# EAGLE design SparkFun_GP-2106_Breakout (EAGLE 7.2.0)
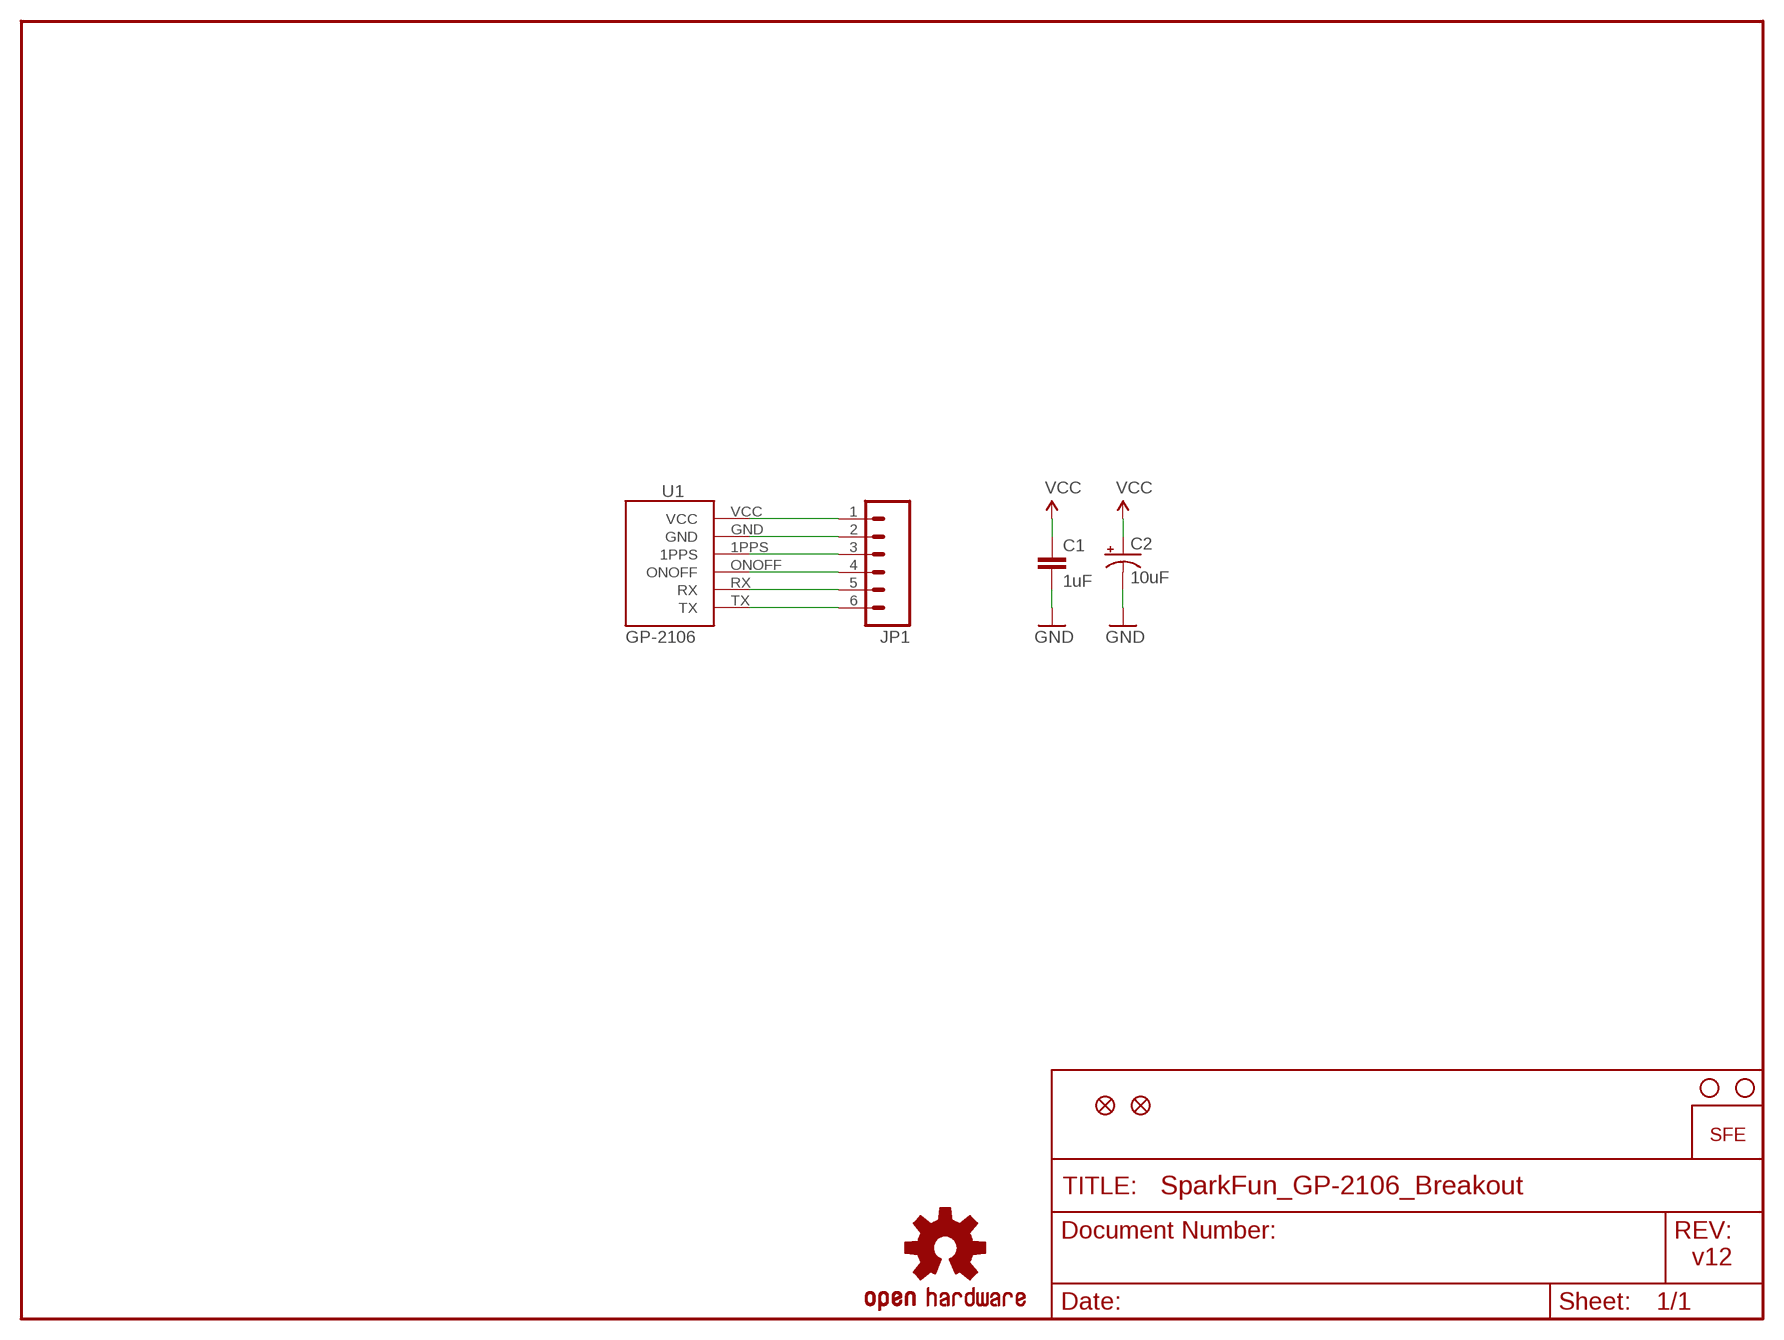
[diagram p0: schematic, sheet 1]

## Parts
C1  1uF  CAP0402-CAP  [0402-CAP]
C2  10uF  CAP_POL1206  [EIA3216]
JP1  M06SIP  [1X06]
JP2  STAND-OFF  [STAND-OFF]
JP3  STAND-OFF  [STAND-OFF]
JP4  LOGO-SFESK  [SFE-LOGO-FLAME]
JP5  FIDUCIALUFIDUCIAL  [MICRO-FIDUCIAL]
JP6  FIDUCIALUFIDUCIAL  [MICRO-FIDUCIAL]
U1  GP-2106  [GP-2106]
U$1  OSHW-LOGOS  [OSHW-LOGO-S]

## Nets
1PPS: JP1.3 U1.1PPS
GND: C1.2 C2.C(-) JP1.2 U1.GND
ONOFF: JP1.4 U1.ONOFF
RX: JP1.5 U1.RX
TX: JP1.6 U1.TX
VCC: C1.1 C2.A(+) JP1.1 U1.VCC

## Notes on the sheet
- v12

## Library data of the parts
C1 = SparkFun:CAP: Capacitor Standard 0603 ceramic capacitor, and 0.1" leaded capacitor.
C2 = SparkFun:CAP_POL: Capacitor Polarized These are standard SMD and PTH capacitors. Normally 10uF, 47uF, and 100uF in electrolytic and tantalum varieties. Always verify the external diameter of the through hole cap, it varies with capacity, voltage, and manufacturer. The EIA devices should be standard.
JP1 = SparkFun:M06: Header 6 Standard 6-pin 0.1" header. Use with straight break away headers (SKU : PRT-00116), right angle break away headers (PRT-00553), swiss pins (PRT-00743), machine pins (PRT-00117), and female headers (PRT-00115). Molex polarized connector foot print use with SKU : PRT-08094 with associated crimp pins and housings. NOTES ON THE VARIANTS LOCK and LOCK_LONGPADS... This footprint was designed to help hold the alignment of a through-hole component (i.e. 6-pin header) while soldering it into place. You may notice that each hole has been shifted either up or down by 0.005 of an inch from it's more standard position (which is a perfectly straight line). This slight alteration caused the pins (the squares in the middle) to touch the edges of the holes. Because they are alternating, it causes a "brace" to hold the component in place. 0.005 has proven to be the perfect amount of "off-center" position when using our standard breakaway headers. Although looks a little odd when you look at the bare footprint, once you have a header in there, the alteration is very hard to notice. Also, if you push a header all the way into place, it is covered up entirely on the bottom side. This idea of altering the position of holes to aid alignment will be further integrated into the Sparkfun Library for other footprints. It can help hold any component with 3 or more connection pins.
JP2 JP3 = SparkFun:STAND-OFF: Stand Off This is the mechanical footprint for a #4 phillips button head screw. Use the keepout ring to avoid running the screw head into surrounding components. SKU : PRT-00447
JP4 = SparkFun:LOGO-SFE: Spark Fun Electronics PCB Logo This is the standard Spark Fun Electronics PCB logo.
JP5 JP6 = SparkFun:FIDUCIAL: Fiducial Alignment Points Various fiducial points for machine vision alignment.
U1 = SparkFun:GP-2106: GP-2106 GPS SiRF IV
U$1 = SparkFun:OSHW-LOGO: Open Source Hardware Logo This logo indicates the piece of hardware it is found on incorporates a OSHW license and/or adheres to the definition of open source hardware found here: http://freedomdefined.org/OSHW

## Board
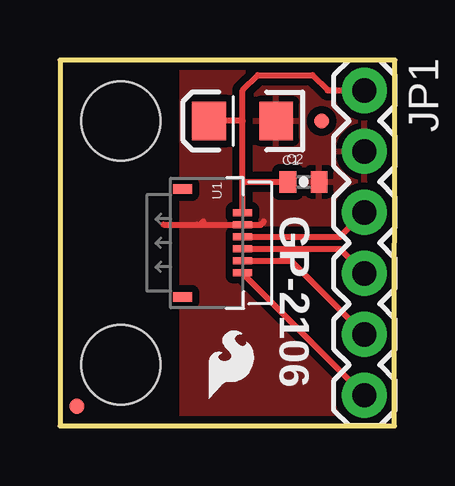
[diagram p1: board, top side]
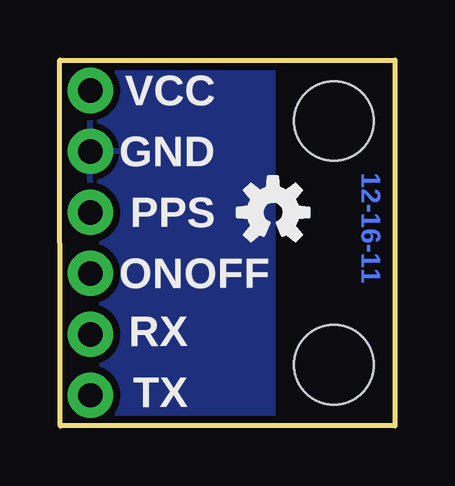
[diagram p2: board, bottom side, seen from below]

Size 13.97 x 15.24 mm. Coordinates in mm from the lower left corner, seen from the top.
Outline: 0,0 13.95,0 13.97,15.24 0,15.24 0,0
Copper layers (1*16): Top 0.0356mm / dielectric 1.5011mm / Bottom 0.0356mm
Design rules "default": minimum track width 8mil, minimum drill 20mil, track to track 8mil, track to pad 8mil, pad to pad 8mil, via to via 8mil, smd to smd 8mil, copper to edge 10mil, drill to drill 8mil, minimum pad ring 12mil, minimum via ring 10mil, stop-mask expansion 4mil, vias tented up to drill 20mil, thermal gap 10mil

### Footprints (pad centres in the part's own frame; a part is rotated, then mirrored left to right if it is on the bottom)
0402-CAP = smd 0.7 x 0.9: 1 -0.65,0; 2 0.65,0
EIA3216 = smd 1.4 x 1.6: A 1.4,0; C -1.4,0
1X06 = drill 1.016 pad 1.88: 1 0,0; 2 2.54,0; 3 5.08,0; 4 7.62,0; 5 10.16,0; 6 12.7,0
STAND-OFF = hole 3.302: 0,0
MICRO-FIDUCIAL = smd 0.635 x 0.635: 1 0,0
GP-2106 = smd 0.3 x 0.8: 1PPS -0.25,0; GND -0.75,0; ONOFF 0.25,0; RX 0.75,0; TX 1.25,0; VCC -1.25,0 | smd 0.4 x 0.8: P$7 -2.25,-2.5; P$8 2.25,-2.5

### Placement (x,y rotation side)
C1  10.16,10.16 0 top
C2  7.62,12.7 180 top
JP1  12.7,13.97 270 top
JP2  2.54,2.54 0 top
JP3  2.54,12.7 0 top
JP4  6.22,1.14 0 top
JP5  10.92,12.7 0 top
JP6  0.71,0.81 0 top
U1  7.62,7.62 270 top
U$1  5.08,8.89 0 bottom

### Tracks (layer width: path | path; a pad name or v marks a point on that pad's centre or on a via)
1PPS
  Top 0.254: U1.1PPS 11.68,7.87 JP1.3
GND
  Top 0.254: 5.71,8.38 5.7,8.37 U1.GND 8.37,8.37 8.51,8.51 | 4.32,8.38 5.71,8.38 | 5.71,8.38 5.84,8.38 5.97,8.51
  pour Top (isolate 0.305): 5.08,15.24 5.08,3.81 5.08,0 13.97,0 13.97,15.24
  pour Bottom (isolate 0.305): 5.08,15.24 5.08,3.81 5.08,0 13.97,0 13.97,15.24
ONOFF
  Top 0.254: U1.ONOFF 11.68,7.37 JP1.4
RX
  Top 0.254: U1.RX 9.64,6.87 JP1.5
TX
  Top 0.254: U1.TX 7.6,6.37 JP1.6
VCC
  Top 0.254: U1.VCC 7.62,10.16 | 7.62,10.16 7.62,12.7 | 7.62,12.7 C2.A | JP1.1 11.18,13.97 10.54,14.61 8.26,14.61 7.62,13.97 7.62,12.7 | 7.62,10.16 C1.1

### Text on the board
Bottom: 12-16-11
tPlace: GP-2106
bPlace: VCC | GND | PPS | ONOFF | RX | TX